# Altium schematic sheet Bop_it Schematic.SchDoc
size A; SheetNumber: 1; SheetTotal: 1
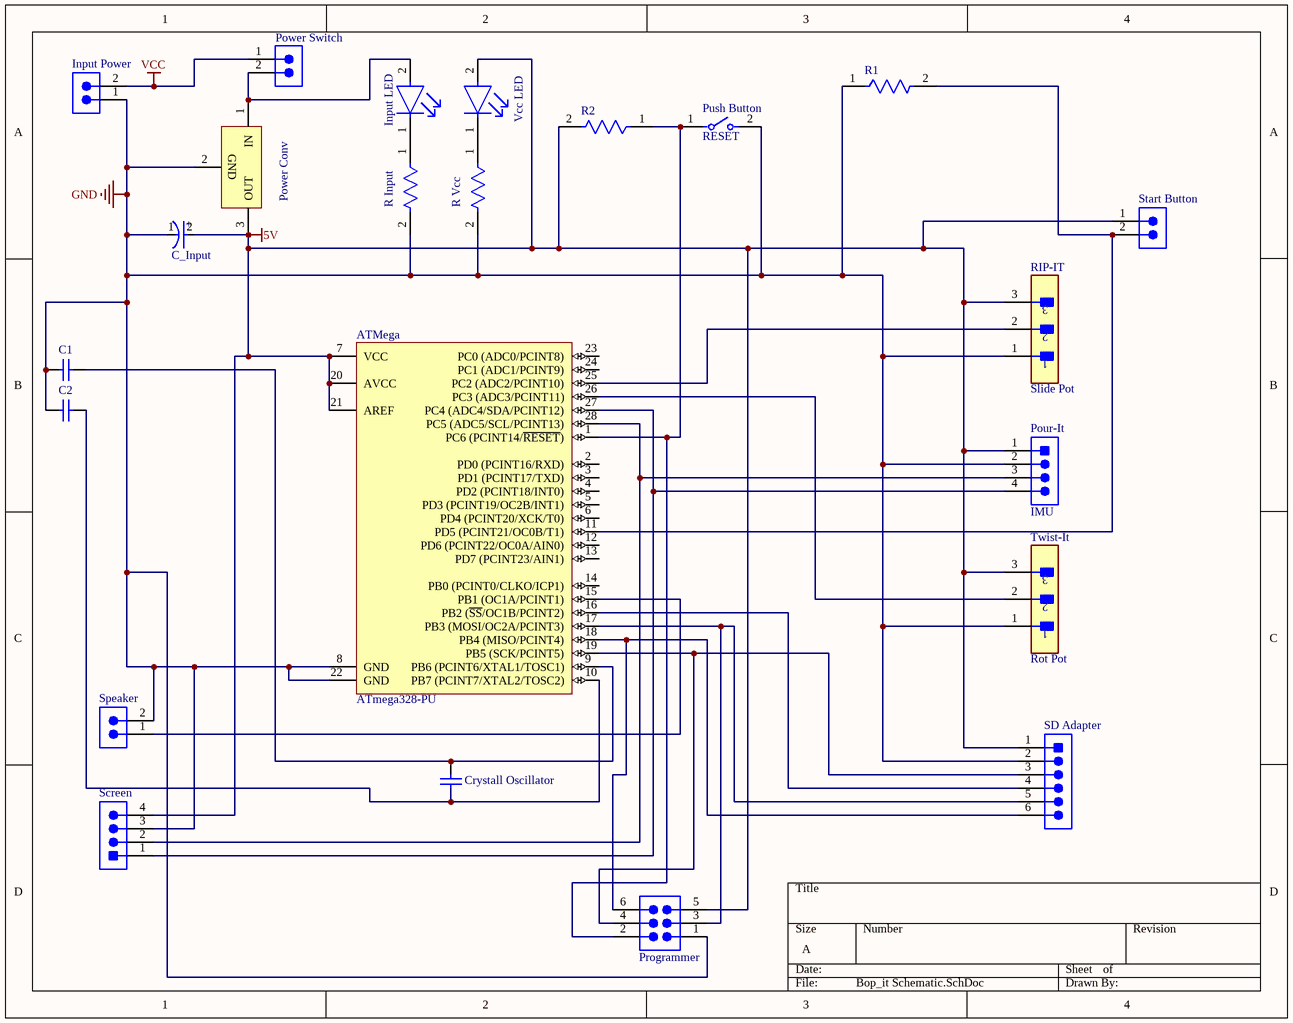
[diagram p0: Bop_it Schematic.SchDoc]

## Parts
ATMega  ATmega328-PU  [28P3]
C1  C330C105M5U5TA  [KEMT-C330C105M5U5TA]  (value not drawn)
C2  C330C105M5U5TA  [KEMT-C330C105M5U5TA]  (value not drawn)
C_Input  25ZL680MEFC10X20  [FP-ZL10X20-MFG]  (value not drawn)
Crystall_Oscillator  C330C105M5U5TA  [KEMT-C330C105M5U5TA]  (value not drawn)
Input_LED  (no value)  [FP-6_544-5255_01-4-MFG]
Input_Power  61300211121  [61300211121]  (value not drawn)
Pour-It  IMU  [TECO-640456-4]
Power_Conv  L7805CV  [TO220]  (value not drawn)
Power_Switch  61300211121  [61300211121]  (value not drawn)
Programmer  TSW-103-08-G-D  [SMTC-TSW-103-08-X-D]  (value not drawn)
Push_Button  RESET  [FP-FSM4JRT-MFG]
R1  (no value)  [FP-MRS25-MFG]
R2  MRS25000C1000FRP00  [FP-MRS25-MFG]  (value not drawn)
R_Input  MRS25000C1000FRP00  [FP-MRS25-MFG]  (value not drawn)
R_Vcc  MRS25000C1000FRP00  [FP-MRS25-MFG]  (value not drawn)
RIP-IT  Slide Pot  [FP-90120-0763-MFG]
Screen  640456-4  [TECO-640456-4]  (value not drawn)
SD_Adapter  22-23-2061  [MOLX-22-23-2061_V]  (value not drawn)
Speaker  61300211121  [61300211121]  (value not drawn)
Start_Button  61300211121  [61300211121]  (value not drawn)
Twist-It  Rot Pot  [FP-90120-0763-MFG]
Vcc_LED  TLLG4401  [FP-6_544-5255_01-4-MFG]  (value not drawn)

## Nets
5V: ATMega.7(VCC) ATMega.20(AVCC) ATMega.21(AREF) C_Input.2(A) Pour-It.1 Power_Conv.3(OUT) Programmer.5 R2.2 RIP-IT.3 Screen.4 SD_Adapter.1 Start_Button.1 Twist-It.3 Vcc_LED.2(A)
GND: ATMega.8(GND) ATMega.22(GND) C1.1 C2.1 C_Input.1(C) Input_Power.1 Pour-It.2 Power_Conv.2(GND) Programmer.1 Push_Button.2 R1.1 R_Input.2 R_Vcc.2 RIP-IT.1 Screen.3 SD_Adapter.2 Speaker.2 Twist-It.1
VCC: Input_Power.2 Power_Switch.1
NetATMega_1: ATMega.1(PC6_(PCINT14/~{RESET})) Programmer.2 Push_Button.1 R2.1
NetATMega_9: ATMega.9(PB6_(PCINT6/XTAL1/TOSC1)) C1.2 Crystall_Oscillator.2
NetATMega_10: ATMega.10(PB7_(PCINT7/XTAL2/TOSC2)) C2.2 Crystall_Oscillator.1
NetATMega_11: ATMega.11(PD5_(PCINT21/OC0B/T1)) R1.2 Start_Button.2
NetATMega_15: ATMega.15(PB1_(OC1A/PCINT1)) Speaker.1
NetATMega_16: ATMega.16(PB2_(~{SS}/OC1B/PCINT2)) SD_Adapter.4
NetATMega_17: ATMega.17(PB3_(MOSI/OC2A/PCINT3)) Programmer.3 SD_Adapter.5
NetATMega_18: ATMega.18(PB4_(MISO/PCINT4)) Programmer.6 SD_Adapter.6
NetATMega_19: ATMega.19(PB5_(SCK/PCINT5)) Programmer.4 SD_Adapter.3
NetATMega_25: ATMega.25(PC2_(ADC2/PCINT10)) RIP-IT.2
NetATMega_26: ATMega.26(PC3_(ADC3/PCINT11)) Twist-It.2
NetATMega_27: ATMega.27(PC4_(ADC4/SDA/PCINT12)) Pour-It.4 Screen.1
NetATMega_28: ATMega.28(PC5_(ADC5/SCL/PCINT13)) Pour-It.3 Screen.2
NetInput_LED_1: Input_LED.1(C) R_Input.1
NetInput_LED_2: Input_LED.2(A) Power_Conv.1(IN) Power_Switch.2
NetR_Vcc_1: R_Vcc.1 Vcc_LED.1(C)

Not connected (* = marked no-connect by the designer): ATMega 2(PD0_(PCINT16/RXD)) 3(PD1_(PCINT17/TXD)) 4(PD2_(PCINT18/INT0)) 5(PD3_(PCINT19/OC2B/INT1)) 6(PD4_(PCINT20/XCK/T0)) 12(PD6_(PCINT22/OC0A/AIN0)) 13(PD7_(PCINT23/AIN1)) 14(PB0_(PCINT0/CLKO/ICP1)) 23(PC0_(ADC0/PCINT8)) 24(PC1_(ADC1/PCINT9))

## Notes on the sheet
- (in symbol CMP-35376-000011-1) +

## Library data of the parts
ATMega = CMP-0095-00015-2: 8-bit AVR Microcontroller, 32KB Flash, 1KB EEPROM, 2KB SRAM, 28-pin PDIP, Industrial Grade (-40°C to 85°C); ComponentLink3Description: ATmega48A/48PA/88A/88PA/168A/168PA/328/328P Summary; RevisionNote: DatasheetVersion updated. URLs added.; DatasheetVersion: revD, May-2011; ComponentLink1URL: http://www.atmel.com/; PackageVersion: revB, Sep-2001; PackageDescription: 28-lead (0.300"/7.62mm Wide) Plastic Dual Inline Package (PDIP); PackageReference: 28P3; ComponentLink1Description: Manufacturer URL; ComponentLink2Description: ATmega48A/48PA/88A/88PA/168A/168PA/328/328P Datasheet; ComponentLink3URL: http://www.atmel.com/dyn/resources/prod_documents/8271S.pdf; ComponentLink2URL: http://www.atmel.com/dyn/resources/prod_documents/8271.pdf
C1 C2 Crystall_Oscillator = CMP-2000-06056-1: Ceramic Capacitor, 1 uF, +/- 20%, 50 V, -10 to 85 degC, 2-Pin THD, RoHS, Bulk; Manufacturer: Kemet; Voltage - Rated: 50V; Temperature Coefficient: Z5U; Catalog Drawings: C330(std); Product Training Modules: CapacitorBasics-TypicalUsesforCapacitors; Capacitance: 1µF; Online Catalog: GoldenMax™Series; Other Names: 399-4390; PCN Design/Specification: C3yySeriesGoldenMaxLeadConfiguration02/Feb/2015; Thickness (Max): -; Size / Dimension: 0.300"Lx0.150"W(7.62mmx3.81mm); Mounting Technology: ThroughHole; Tolerance: ±20%; Mounting Type: ThroughHole; Datasheet URL: http://www.kemet.com/Lists/ProductCatalog/Attachments/599/KEM_C1051_GOLDMAX_Z5U.pdf; Series: GoldenMax™; Standard Package: 250; Ratings: -; Applications: GeneralPurpose; Package Reference: C330C105M5U5TA; Packaging: Bulk; Category: Capacitors; Package Description: 2-Pin Through Hole Device, Body 7.11 x 4.07 mm; Operating Temperature: 10°C~85°C; Height - Seated (Max): 0.360"(9.14mm); Manufacturer URL: http://www.kemet.com/; Lead Spacing: 0.200"(5.08mm); Features: -; Lead Style: Straight; Package / Case: Radial; Family: CeramicCapacitors; Datasheet Version: 12/2015
C_Input = CMP-35376-000011-1: CAP ALUM 680UF 20% 25V RADIAL; Life (Hours): 4000Hour; Leakage Current: 3uA; Dielectric Material: Aluminium; Ripple Current: 1.82A; Lead Diameter: 0.6mm; Impedance: 23mR; Package Quantity: 1000; Radiation Hardening: No; Mount: Through Hole; Termination: Radial; Tolerance: 20%; Capacitance: 680uF; Construction: RADIAL; Diameter: 10mm; Max Operating Temperature: 105°C; Voltage Rating: 25V; Series: ZL; Case/Package: Radial; RoHS Compliant: Yes; Packaging: Bulk; Lead Pitch: 5mm; Height - Seated (Max): 0.866inch; Height: 20mm; Voltage: 25V; Min Operating Temperature: -40°C
Input_LED Vcc_LED = CMP-00030-39390728-1: TLLG4401 LED, Green, 2mcd, 3mmDia., T-1, +/-25deg, 565nm, 7mA, 1.9V Vf, 20V Vr, 20mW, -40; Test Current: 2mA; Wavelength: 575nm; Number of Elements: 1; Viewing Angle: 25°; Lens Transparency: Diffused; Voltage Rating (DC): 2.4V; Lead Length: 23mm; Max Junction Temperature (Tj): 100°C; Lens Style: Circular, Colored, Diffused, Dome, Round, Tinted; Reverse Voltage: 6V; Forward Voltage: 1.9V; Length: 3.2mm; Forward Current: 2mA; Color: Green; Dominant Wavelength: 575nm; Radiation Hardening: No; NexarPartId: 39390728; Lens Color: Green; REACH SVHC: Unknown; Lead Free: Lead Free; Number of Pins: 2; Luminous Intensity: 2mcd; Schedule B: 8541402000, 8541402000; Max Operating Temperature: 100°C; Illumination Color: Green; Mount: Through Hole; Packaging: Bulk; Depth: 3.2mm; Ambient Temperature Range High: 100°C; Case/Package: Radial; Power Dissipation: 20mW; Height: 4.5mm; RoHS: Compliant; Peak Wavelength: 565nm; Min Operating Temperature: -40°C; Number of LEDs: 1
Input_Power Power_Switch Speaker Start_Button = CMP-1712-00002-5: NexarPartId: 20081794; Operating Supply Voltage: 250V; Current Rating: 3A; Gender: Male; Number of Contacts: 2; Pitch: 2.54mm; Connector Type: Male Pin; Contact Resistance: 20mΩ; Contact Plating: Gold; Contact Material: Copper; Number of Pins: 2; Min Operating Temperature: -40°C; Packaging: Bulk; Lead Pitch: 2.54mm; Mount: Through Hole; Orientation: Vertical; RoHS: Compliant; REACH SVHC: No SVHC; Height: 8.94mm; Termination: Through Hole; Number of Positions: 2; Contact Mating Length: 5.9944mm; Color: Black; Contact Gender: Male; Number of Rows: 1; Housing Material: PBT; Lead Free: Lead Free; Voltage Rating: 250V; Max Operating Temperature: 125°C
Pour-It Screen = CMP-2000-05419-1: Male Header, Pitch 2.54 mm, 1 x 4 Position, Height 10.03 mm, Tail Length 3.56 mm, RoHS, Bulk; Manufacturer: TE Connectivity; Material, Housing: Polyester; Primary Type: InterconnectSystem; Mount Angle: Vertical; Color, Housing: White; Current, Rating: 5 / A; Agency Approvals: CSA,UL; Contact Termination Area Plating: Tin; Temperature, Operating: -55to+105 / degC; Standards: RoHSCompliant,ELVCompliant,UL94V-0; Number of Positions: 4; Brand/Series: MTA-100Series; Angle: Straight; Pin Spacing: 0.1 / "; Material, Contact: CopperAlloy; Connector Type: MTA-100; Special Features: Pinstrip; Mounting Hole Size: 0.04 / "; Contact Centerline Spacing: 0.100 / in.; Voltage, Rating: 250 / V; Manufacturer URL: http://www.te.com/; Length, Pin: 0.14 / "; Length, Overall: 0.4 / "; Color: White; Flammability Rating: UL94V-0; Mounting Type: PCMount; Termination: Solder; Datasheet URL: https://datasheet.ciiva.com/16286/eng-ds-82056-mta-0608-16286228.pdf; Number of Contacts: 4; Contact Shape: Square; Contact Mating Area Plating: Tin; Length, Terminal Post: 0.14 / in.; Size, Post: 0.025 / in.; Contact Plating: Tin; Type: PCBPlug; Datasheet Version: Dec-14; Number of Rows: 1
Power_Conv = CMP-0244-00483-1: Positive Voltage Regulator, 5V, 3-Pin TO-220; PackageDescription: TO, Thru-Hole, Vertical, Heatsink Mounted; 3 In-Line Leads; Pitch 2.54 mm; ComponentLink2Description: Datasheet; PackageReference: TO220; ComponentLink3URL: http://www.st.com/internet/com/TECHNICAL_RESOURCES/TECHNICAL_LITERATURE/PACKAGE_INFORMATION/CD00004649.pdf; DatasheetVersion: 16/11/2011; ComponentLink1Description: Manufacturer URL; ComponentLink1URL: http://www.st.com; PackageVersion: ver3.0; ComponentLink3Description: Package Specification; ComponentLink2URL: http://www.st.com/internet/com/TECHNICAL_RESOURCES/TECHNICAL_LITERATURE/DATASHEET/CD00000444.pdf
Programmer = CMP-1024-00338-1: 0.025" SQ Post Header, Through-hole, Vertical, -55 to 125 degC, 2.54 mm Pitch, 6-Pin, Male, RoHS; Manufacturer: Samtec; Pitch: 2.54 mm; ComponentLink1URL: http://www.samtec.com; ComponentLink2URL: http://www.samtec.com/documents/webfiles/pdf/TSW_TH.PDF; Temperature Range: -55 to 125 degC; RoHS: True; ComponentLink2Description: Datasheet; PackageReference: TSW-103-08-X-D; ComponentLink3Description: Package Specification; PackageDescription: .025[0.64] SQ. Post Terminal Strip Assembly; DatasheetVersion: F-214; Mounting Technology: Through-hole; ComponentLink1Description: Manufacturer URL; Orientation: Vertical; PartNumber: TSW-103-08-G-D; PackageVersion: DM, 8/1988; ComponentLink3URL: http://www.samtec.com/documents/webfiles/cpdf/TSW-XXX-XX-XXX-X-XX-XXX-MKT.pdf
Push_Button = CMP-03407-000038-1: SWITCH TACTILE SPST-NO 0.05A 24V; Current Rating: 50mA; Actuator Diameter: 3.5mm; Max Voltage Rating (DC): 12V; Actuator Length: 0.055inch; Switch Travel: 0.25mm; Actuator Type: Standard; Contact Resistance: 100mR; Illumination Type: Non-Illuminated; Electrical Life: 100000Cycles; Throw Configuration: SPST; Switch Function: Off-Mom; Actuator Material: Resin; Operating Force: 1.57N; Series: FSMJRT; Min Operating Temperature: -35°C; Max Current Rating: 50mA; Termination: PC Pins; Type: Switch; Radiation Hardening: No; Max Operating Temperature: 105°C; Voltage Rating (DC): 12V; Contact Material: Copper Alloy; Contact Current Rating: 50mA; RoHS Compliant: Yes; Mechanical Life: 100000Cycles; Mount: Through Hole; Package Quantity: 10000; Case/Package: Radial; Packaging: Tape and Reel; Length: 6.19mm; Contact Plating: Silver; Depth: 6.19mm; Orientation: Straight
R1 R2 R_Input R_Vcc = CMP-00030-42757237-1: MRS25000C1000FRP00 Resistor, 100 Ohm, ± 1%, 600 mW, Axial Leaded, Metal Film (Thin Film), Professional; Max Power Dissipation: 600mW; Resistance: 100Ω; Voltage Rating: 350V; Temperature Coefficient: 50ppm/°C; Lead Diameter: 600µm; RoHS: Compliant; Radiation Hardening: No; Schedule B: 8533210090, 8533210090; Length: 6.5mm; Packaging: Tape & Reel (TR); Number of Terminations: 2; Mount: Through Hole; Width: 2.5mm; Tolerance: 1%; Military Standard: Not; Voltage Rating (DC): 350V; Contact Plating: Tin; Number of Pins: 2; Max Operating Temperature: 155°C; NexarPartId: 42757237; Diameter: 2.5mm; Composition: Metal Film, Thin Film; REACH SVHC: Unknown; Power Rating: 600mW; Lead Free: Lead Free; Termination: Axial; Case/Package: Axial; Min Operating Temperature: -55°C
RIP-IT Twist-It = CMP-04776-000084-1: CONN HEADER VERT 3POS 2.54MM; Manufacturer Part Number: 90120-0763; Manufacturer: Molex; Voltage Rating: 350V; Number Of Contacts: 3; Conn Orientation: Vertical; Current Rating: 3A; Conn Gender: Male; Package: 90120-0763; ComponentLink2Description: Datasheet; Height: 5.8mm; Temperature Range High: +125°C; RoHS: TRUE; ComponentLink2URL: https://www.molex.com/webdocs/datasheets/pdf/en-us/0901200763_PCB_HEADERS.pdf; Device Class L2: Headers and Wire Housings; Temperature: -55°C to +125°C; Device Class L1: Connectors; Pitch: 2.54mm; Footprint Url: https://www.molex.com/pdm_docs/sd/901200763_sd.pdf; Device Class L3: unset; Temperature Range Low: -55°C; Number Of Rows: 1; Category: Conn; Lead Free: Yes; Mouser Description: Board-To-Board Connector, C-Grid III 90120 Series, Through Hole, Header, 3, 2.54 mm; Octopart: https://octopart.com/90120-0763-molex-655433; Contact Material: Gold,Nickel; Automotive: No; Digikey Description: CONN HEADER VERT 3POS 2.54MM
SD_Adapter = CMP-2000-05536-1: Male Header, Pitch 2.54 mm, 1 x 6 Position, Height 10.67 mm, Tail Length 3.56 mm, 0 to 70 degC, RoHS, Bulk; Manufacturer: Molex; Pitch: 2.54mm; Mounting Angle: Vertical; Current Rating: 4A; Number of Positions / Contacts: 6; Voltage Rating: 250V; Packaging: Bulk; Package Description: Male Header, Pitch 2.54 mm, 1 x 6 Position, Height 10.67 mm, Tail Length 3.56 mm; Number of Rows: 1; Type: PinStrip; Contact Material: Brass; Product Category: .100K.K.Connectors; Factory Pack Quantity: 1000; Mounting Style: ThroughHole; RoHS: Details; Contact Plating: Tin; Housing Material: Nylon; Mounting Technology: ThroughHole; Termination Style: ThroughHole; Tradename: KK; Number of Positions: 6; Brand: Molex; Product Type: Headers; Series: 6373; Datasheet URL: https://datasheet.ciiva.com/19460/232303-19460895.pdf; Package Reference: 22-23-2061; Datasheet Version: Rev. P, 09/2001; Manufacturer URL: http://www.molex.com/